# Altium schematic sheet Drivers.SchDoc
size Letter; SheetNumber: 4; SheetTotal: 4
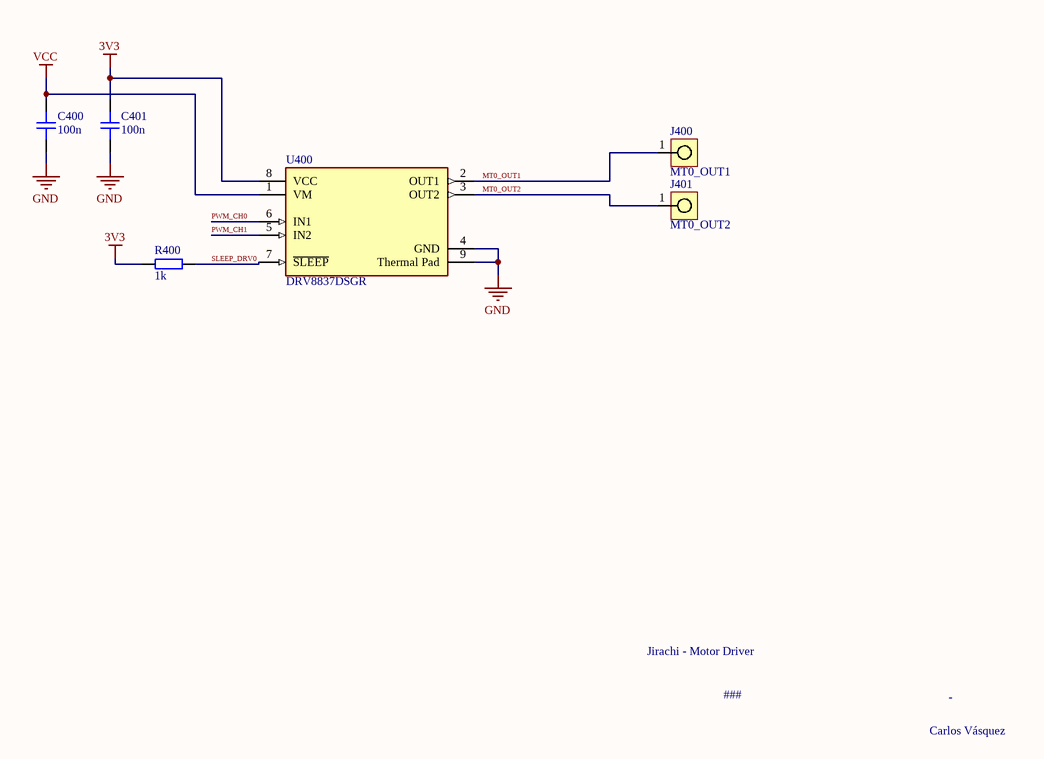
[diagram p0: Drivers.SchDoc]

## Parts
C400  100n  [CAP_0402]
C401  100n  [CAP_0402]
J400  MT0_OUT1  [SOLDER_PIN_THT_1_5]
J401  MT0_OUT2  [SOLDER_PIN_THT_1_5]
R400  1k  [RES_0402]
U400  DRV8837DSGR  [FP-DSG0008A-MFG]

## Nets
3V3: C401.2 R400.2 U400.8(VCC)
GND: C400.1 C401.1 U400.4(GND) U400.9(Thermal_Pad)
VCC: C400.2 U400.1(VM)
MT0_OUT1: J400.1 U400.2(OUT1)
MT0_OUT2: J401.1 U400.3(OUT2)
PWM_CH0: U400.6(IN1)
PWM_CH1: U400.5(IN2)
SLEEP_DRV0: R400.1 U400.7(~{SLEEP})

## Notes on the sheet
- Jirachi - Motor Driver
- ###
- -
- Carlos Vásquez

## Library data of the parts
C400 C401 = CAP_0402: Capacitor SMD 0402; Manufacturer: *; Manufacturer Part Number: *; Distributor Link: *; LCSC: *; Rating: *; Dielectric: *
J400 J401 = SOLDER_PIN_THT: Solder Pin 1.5mm Through-Hole
R400 = RES_0402: Resistor SMD 0402; Manufacturer: *; Manufacturer Part Number: *; Distributor Link: *; LCSC: *
U400 = CMP-04915-000004-1: IC MOTOR DRIVER PAR 8WSON; Manufacturer: Texas Instruments; Switching Frequency: 0-250kHz; Min Supply Voltage: 1.8V; Standoff Height: 0mm; Max Supply Voltage: 7V; Output Voltage: 0-11V; Motor Type: Brushed; Number Of Outputs: 2; Output Current: 1.8A; Max Junction Temp: +150°C; Nominal Supply Current: 300-700uA; Mouser Description: Motor / Motion / Ignition Controllers & Drivers 1.8A Low Vltg Brush DC Motor Driver; Device Class L2: Power Management ICs; Manufacturer Part Number: DRV8837DSGR; Temperature Range Low: -40°C; Lead Free: Yes; Height: 0.8mm; Device Class L3: Motor Drivers; Octopart: https://octopart.com/drv8837dsgr-texas+instruments-23786726; Package: DSG0008A; ComponentLink2URL: http://www.ti.com/lit/ds/symlink/drv8837.pdf; Temperature: -40°C to +85°C; Ambient Temperature Range Low: -40°C; ComponentLink2Description: Datasheet; Ambient Temperature Range High: +85°C; Device Class L1: Integrated Circuits (ICs); Category: IC; Temperature Range High: +85°C; RoHS: TRUE; Automotive: No; Digikey Description: IC MOTOR DRIVER PAR 8WSON